# EasyEDA Pro project ProPrj_FireWheels_2025-05-03.epro, board PCB1
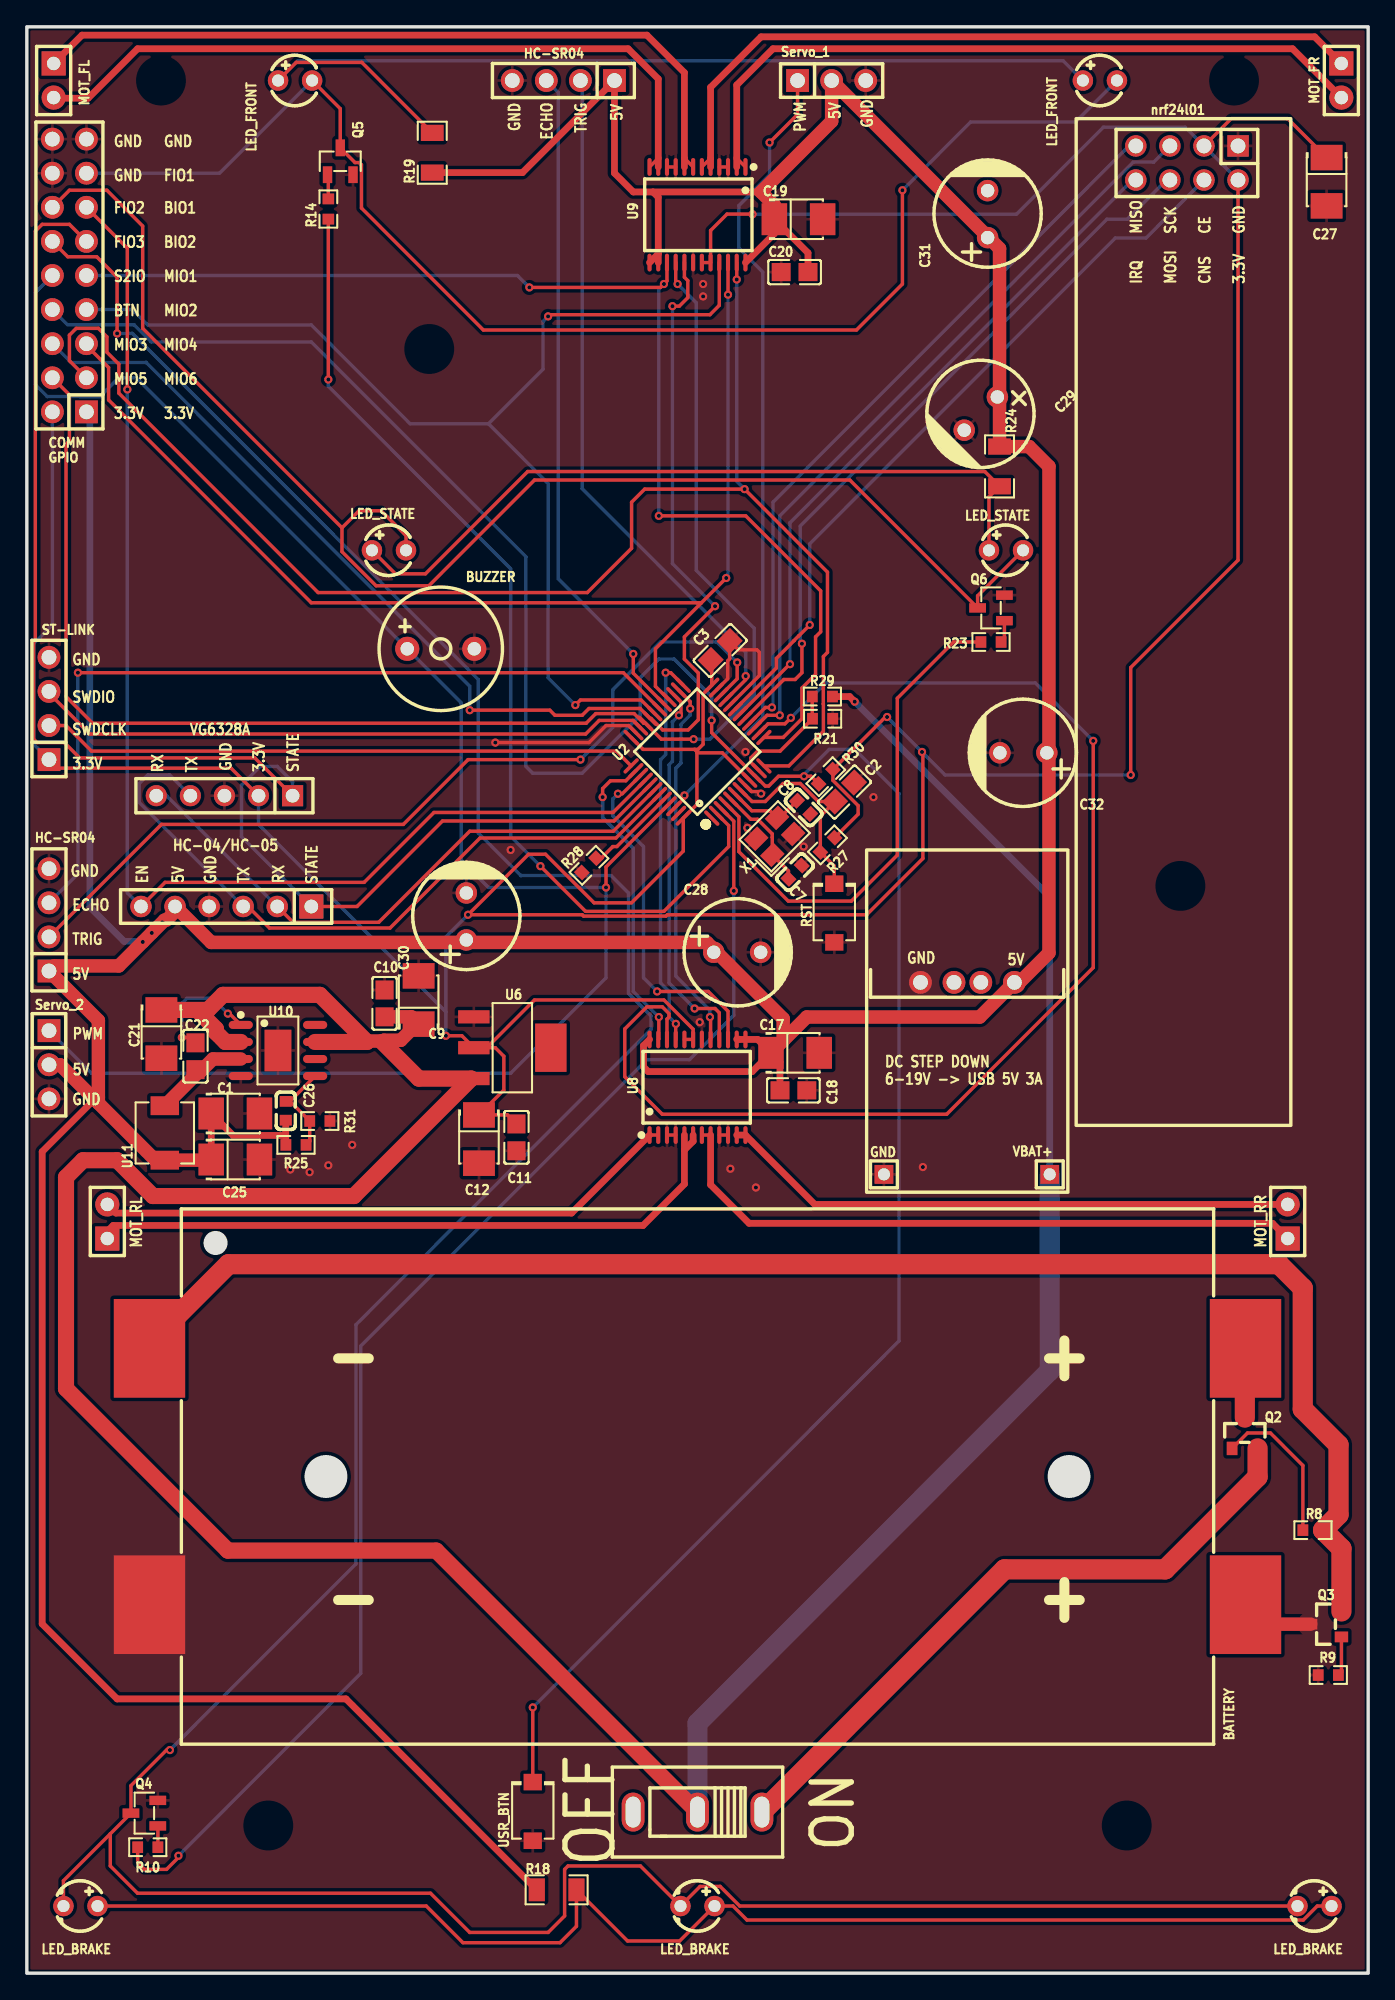
[diagram p2: board, top side]
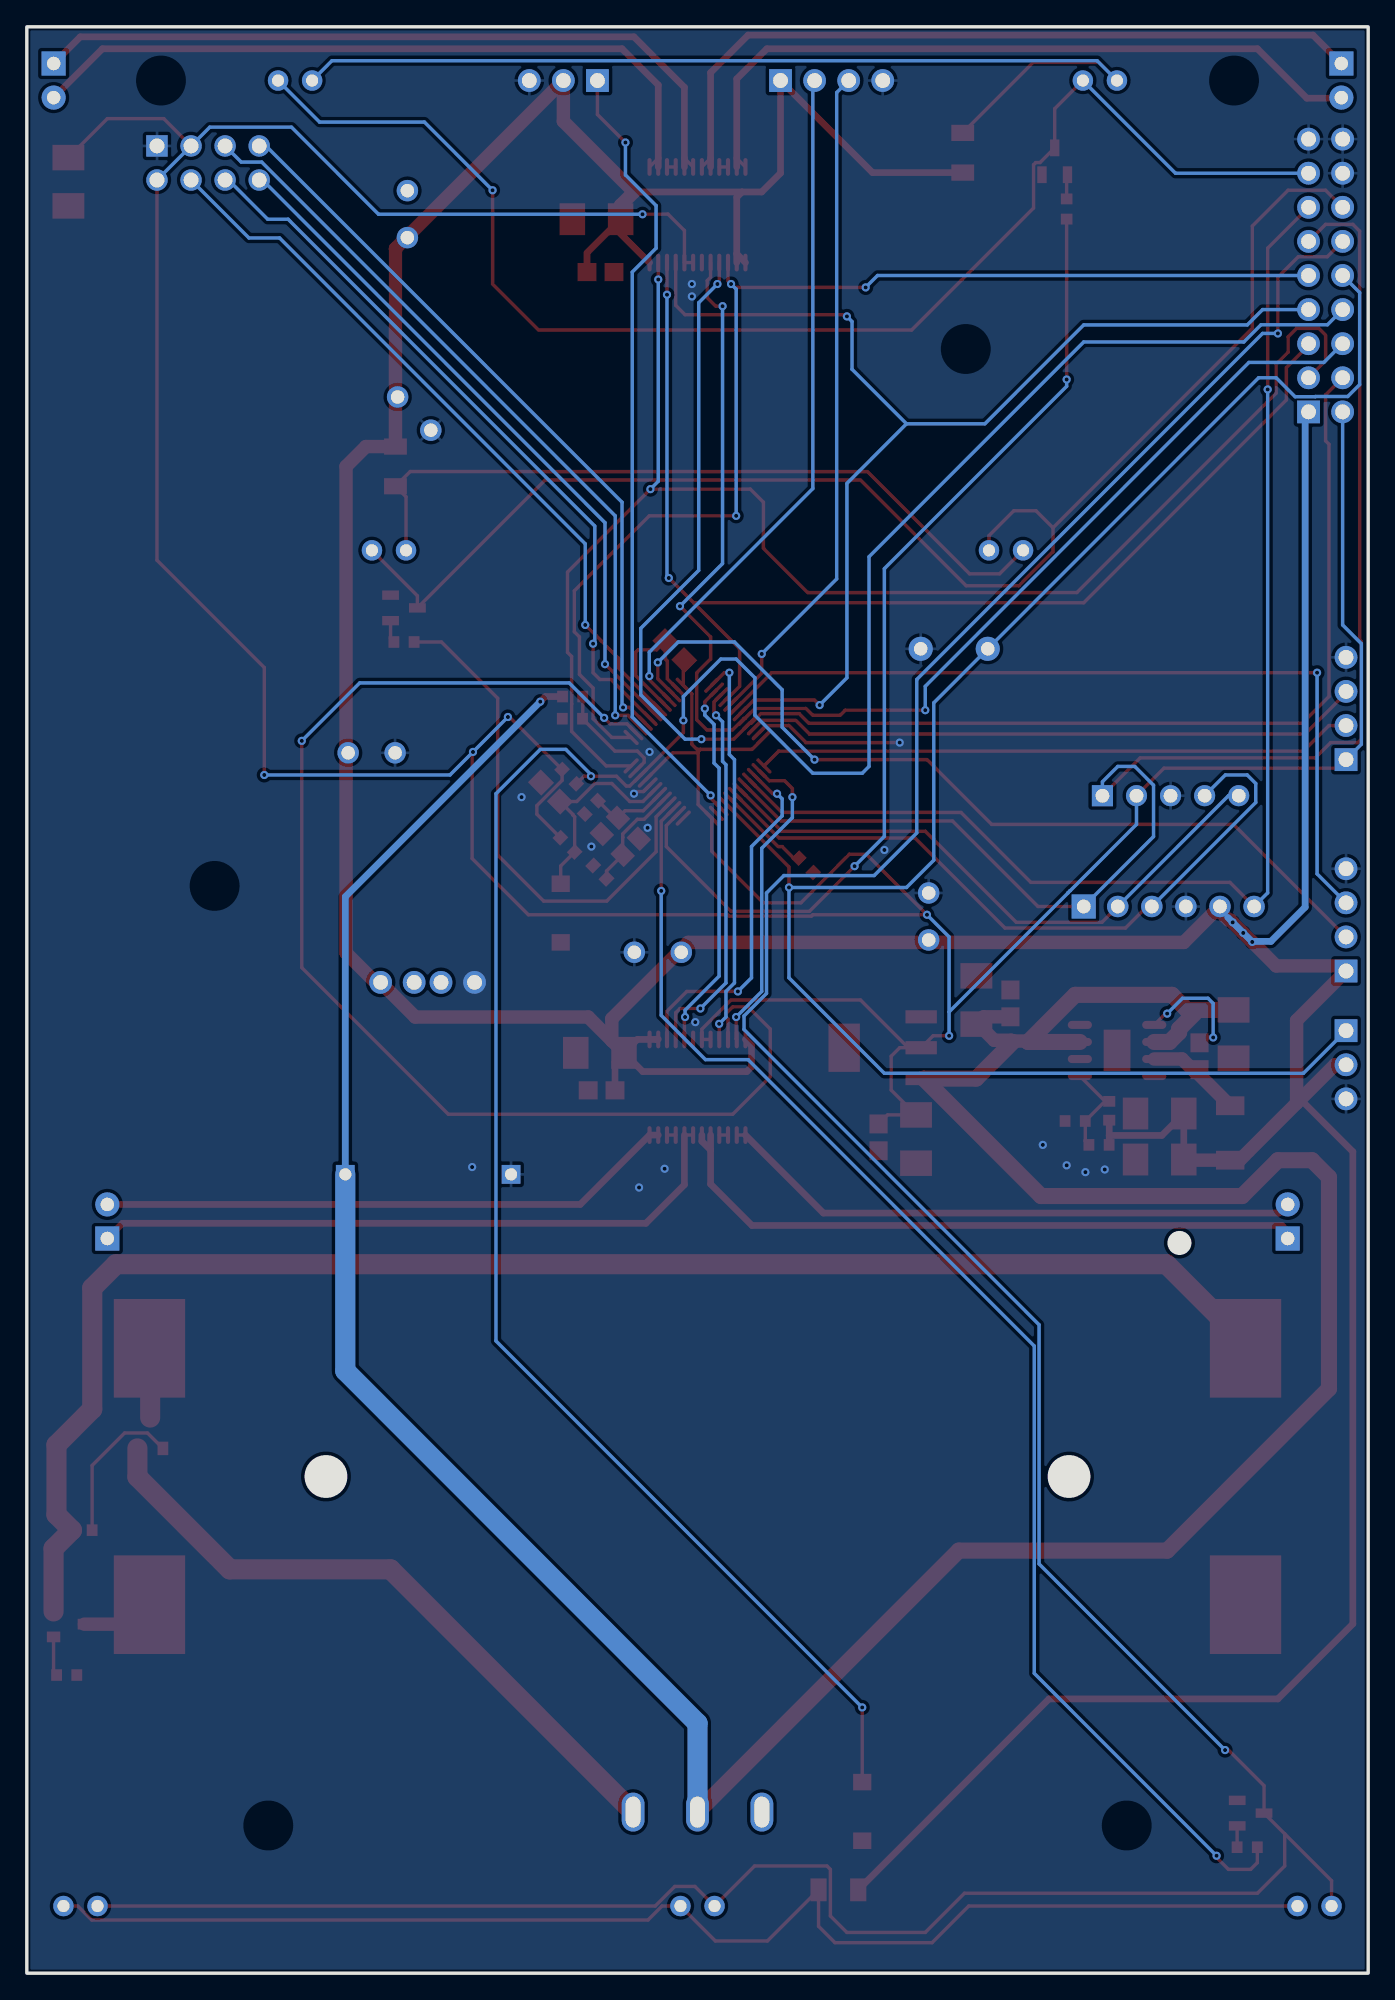
[diagram p3: board, bottom side, seen from below]

Outline 100 x 145 mm; copper layers: Top Layer, Bottom Layer. Coordinates in mm from the lower left corner of the outline.
Outline path: rectangle 0,145 100,0
Stack: Top Layer 0.035mm / Dielectric1 1.51mm FR4 er 4.5 / Bottom Layer 0.035mm

## Design rules (mm)
net VBAT+: POWER
net +5V: POWER
template: Custom Config
spacing copperThickness1oz (default): track to track 0.102, other pairs 0.152 to 0.3
spacing copperThickness2oz: track to track 0.203, other pairs 0.152 to 0.3
track width copperThickness1oz: min 0.127, default 0.254, max 2.54
track width copperThickness2oz: min 0.203, default 0.254, max 2.54
track width trackWidthLogic (default): min 0.127, default 0.254, max 2.54
track width trackWidthPower: min 0.254, default 0.5, max 3
differential pair differentialPair (default): width min 0.127, default 0.254, max 2.54; gap min 0.152, default 0.152
via viaSize (default): diameter min 0.5, default 0.61, max 10; hole min 0.3, default 0.305, max 6.3
net class POWER uses trackWidthPower
net VBAT+ uses trackWidthPower
net +5V uses trackWidthPower

## Placement (name value [footprint] x y rotation side)
BATTERY  -  [BAT-SMD_BH-18650-B1BA007]  50 37 180 top
BUZZER  -  [BUZ-TH_BD9.0-P5.00-D0.6-FD]  30.86 98.66 0 top
C1  22uF  [CAP-SMD_L3.5-W2.8-FD]  15.55 64.04 0 top
C2  100nF  [C0805]  60.96 88 225 top
C3  100nF  [C0805]  51.69 98.54 225 top
C7  20pF  [C0603]  57.28 82.03 225 top
C8  20pF  [C0603]  57.91 86.85 135 top
C9  22uF  [CAP-SMD_L3.5-W2.8-FD]  29.21 72.5 90 top
C10  100nF  [C0805]  26.67 72.25 270 top
C11  100nF  [C0805]  36.5 62.27 90 top
C12  22uF  [CAP-SMD_L3.5-W2.8-FD]  33.71 62.14 270 top
C17  22uF  [CAP-SMD_L3.5-W2.8-FD]  57.28 68.56 0 top
C18  100nF  [C0805]  57.15 65.77 180 top
C19  22uF  [CAP-SMD_L3.5-W2.8-FD]  57.53 130.67 0 top
C20  100nF  [C0805]  57.24 126.73 0 top
C21  22uF  [CAP-SMD_L3.5-W2.8-FD]  10.03 69.96 270 top
C22  100nF  [C0805]  12.57 68.31 270 top
C25  22uF  [CAP-SMD_L3.5-W2.8-FD]  15.55 60.61 0 top
C26  430pF  [C0603]  19.3 64.25 270 top
C27  22uF  [CAP-SMD_L3.5-W2.8-FD]  96.9 133.46 270 top
C28  470uF  [CAP-TH_BD8.0-P3.50-D0.6-FD]  52.96 76.06 0 top
C29  470uF  [CAP-TH_BD8.0-P3.50-D0.6-FD]  71.12 116.19 225 top
C30  470uF  [CAP-TH_BD8.0-P3.50-D0.6-FD]  32.77 78.72 90 top
C31  470uF  [CAP-TH_BD8.0-P3.50-D0.6-FD]  71.63 131.05 90 top
C32  470uF  [CAP-TH_BD8.0-P3.50-D0.6-FD]  74.29 90.92 180 top
COMM
GPIO  -  [HDR-TH_18P-P2.54-V-M-R2-C9-S2.54]  3.17 126.48 90 top
GND  -  [HDR-TH_1P-V-M_XKB_X4611WV-01I-C28D40]  63.9 59.51 0 top
H3  -  [HDR-TH_2P-P2.54-V-M-1]  6 56 90 top
H4  -  [HDR-TH_2P-P2.54-V-M-1]  94 56 90 top
H11  -  [HDR-TH_6P-P2.54-V-F]  14.86 79.47 180 top
H17  -  [HDR-TH_5P-P2.54-V-F]  14.73 87.72 180 top
HC-SR04  -  [HDR-TH_4P-P2.54-V-F]  40 141 180 top
HC-SR04#2  -  [HDR-TH_4P-P2.54-V-F]  1.65 78.47 90 top
LED_BRAKE  -  [LED-TH_BD3.8-P2.54-RD]  4 5 0 top
LED_BRAKE#2  -  [LED-TH_BD3.8-P2.54-RD]  50 5 0 top
LED_BRAKE#3  -  [LED-TH_BD3.8-P2.54-RD]  96 5 0 top
LED_FRONT  -  [LED-TH_BD3.8-P2.54-FD_WHITE]  20 141 0 top
LED_FRONT#2  -  [LED-TH_BD3.8-P2.54-FD_WHITE]  80 141 0 top
LED_STATE  -  [LED-TH_BD3.8-P2.54-FD_BLUE]  73 106 0 top
LED_STATE#2  -  [LED-TH_BD3.8-P2.54-FD_BLUE]  27 106 0 top
MOT_FL  -  [HDR-TH_2P-P2.54-V-M-1]  2 141 270 top
MOT_FR  -  [HDR-TH_2P-P2.54-V-M-1]  98 141 270 top
nrf24l01  -  [HDR-TH_8P-P2.54-V-F-R2-C4-S2.54-1]  86.49 134.86 180 top
ON  -  [SW-TH_SHOU-HAN_SS12D10G4]  50 12 180 top
Q2  AO3401A  [SOT-23_L2.9-W1.3-P1.90-LS2.4-BR]  90.81 40.24 270 top
Q3  AO3401A  [SOT-23_L2.9-W1.3-P1.90-LS2.4-BR]  96.86 26 0 top
Q4  AO3400A  [SOT-23-3_L2.9-W1.3-P1.90-LS2.4-BR]  8.76 11.92 0 top
Q5  AO3400A  [SOT-23-3_L2.9-W1.3-P1.90-LS2.4-BR]  23.37 134.99 270 top
Q6  AO3400A  [SOT-23-3_L2.9-W1.3-P1.90-LS2.4-BR]  71.88 101.71 0 top
R8  100Ω  [R0603]  95.88 33 180 top
R9  100Ω  [R0603]  97.03 22.21 0 top
R10  1kΩ  [R0603]  9.02 9.38 0 top
R14  1kΩ  [R0603]  22.48 131.43 90 top
R18  75Ω  [R1206]  39.5 6.21 0 top
R19  47Ω  [R1206]  30.23 135.62 90 top
R21  5kΩ  [R0603]  59.33 93.46 180 top
R23  1kΩ  [R0603]  71.88 99.17 0 top
R24  47Ω  [R1206]  72.52 112.25 270 top
R25  44.2kΩ  [R0603]  20.07 61.71 180 top
R27  10kΩ  [R0603]  59.69 84.06 45 top
R28  10kΩ  [R0603]  41.91 82.53 45 top
R29  10kΩ  [R0603]  59.31 95.11 180 top
R30  10kΩ  [R0603]  59.56 89.14 45 top
R31  10kΩ  [R0603]  21.84 63.48 0 top
RST  -  [SW-SMD_L3.9-W3.0-P4.45]  60.2 78.98 90 top
Servo_1  -  [HDR-TH_3P-P2.54-V-M]  60 141 0 top
Servo_2  -  [HDR-TH_3P-P2.54-V-M]  1.65 67.67 270 top
ST-LINK  -  [HDR-TH_4P-P2.54-V-M]  1.65 94.22 90 top
U2  STM32F103C8T6  [LQFP-48_L7.0-W7.0-P0.50-LS9.0-BL]  50 91 45 top
U6  AMS1117-3.3  [SOT-223-3_L6.7-W3.7-P2.30-LS7.0-BR]  36.19 68.94 180 top
U8  TB6612FNG,C,8,EL  [SSOP-24_L8.3-W5.6-P0.65-LS7.6-BL]  50 66 0 top
U9  TB6612FNG,C,8,EL  [SSOP-24_L8.3-W5.6-P0.65-LS7.6-BL]  50 131 180 top
U10  MP1484  [SOP-8_L4.9-W3.9-P1.27-LS6.0-BL-EP3.1]  18.72 68.74 270 top
U11  4.7uH  [IND-SMD_L4.4-W4.2]  10.29 62.59 90 top
USB1  AF 90° WJDG  [USB-A-TH_AF-WJDG]  70.1 75.17 180 top
USR_BTN  -  [SW-SMD_L3.9-W3.0-P4.45]  37.72 12.05 90 top
VBAT+  -  [HDR-TH_1P-V-M_XKB_X4611WV-01I-C28D40]  76.26 59.51 0 top
X1  8MHz  [CRYSTAL-SMD_4P-L3.2-W2.5-BL]  55.75 84.69 45 top

## Footprints (pads in the part's own frame, mm; a bottom-side part is the same pattern mirrored in y, then rotated)
BAT-SMD_BH-18650-B1BA007
  rect 5.32x7.35 smd: 1(-40.855,9.55) 2(40.855,9.55) 3(-40.855,-9.55) 4(40.855,-9.55)
BUZ-TH_BD9.0-P5.00-D0.6-FD
  round 1.8 hole 1: 1(-2.5,0) 2(2.5,0)
C0603
  rect 0.8x0.9 smd: 1(-0.7,0) 2(0.7,0)
C0805
  rect 1.41x1.35 smd: 1(-1,0) 2(1,0)
CAP-SMD_L3.5-W2.8-FD
  rect 1.9x2.376 smd: 1(-1.798,0) 2(1.798,0)
CAP-TH_BD8.0-P3.50-D0.6-FD
  round 1.6 hole 1: 1(-1.75,0) 2(1.75,0)
CRYSTAL-SMD_4P-L3.2-W2.5-BL
  rect 1.4x1.2 smd: 1(-1.1,-0.85) 2(1.1,-0.85) 3(1.1,0.85) 4(-1.1,0.85)
HDR-TH_1P-V-M_XKB_X4611WV-01I-C28D40
  rect 1.4x1.4 hole 0.9: 1(0,0)
HDR-TH_2P-P2.54-V-M-1
  rect 1.8x1.8 hole 1: 1(-1.27,0)
  round 1.8 hole 1: 2(1.27,0)
HDR-TH_3P-P2.54-V-M
  rect 1.7x1.7 hole 1.1: 1(-2.54,0)
  round 1.7 hole 1.1: 2(0,0) 3(2.54,0)
HDR-TH_4P-P2.54-V-F
  rect 1.7x1.7 hole 1.1: 1(-3.81,0)
  round 1.7 hole 1.1: 2(-1.27,0) 3(1.27,0) 4(3.81,0)
HDR-TH_4P-P2.54-V-M
  rect 1.7x1.7 hole 1.1: 1(-3.81,0)
  round 1.7 hole 1.1: 2(-1.27,0) 3(1.27,0) 4(3.81,0)
HDR-TH_5P-P2.54-V-F
  rect 1.575x1.575 hole 1.02: 1(-5.08,0)
  round 1.575 hole 1.02: 2(-2.54,0) 3(0,0) 4(2.54,0) 5(5.08,0)
HDR-TH_6P-P2.54-V-F
  rect 1.8x1.8 hole 1.02: 1(-6.35,0)
  round 1.6 hole 1.02: 2(-3.81,0) 3(-1.27,0) 4(1.27,0) 5(3.81,0) 6(6.35,0)
HDR-TH_8P-P2.54-V-F-R2-C4-S2.54-1
  rect 1.6x1.6 hole 1.1: 1(-3.81,-1.27)
  round 1.6 hole 1.1: 2(-3.81,1.27) 3(-1.27,-1.27) 4(-1.27,1.27) 5(1.27,-1.27) 6(1.27,1.27) 7(3.81,-1.27) 8(3.81,1.27)
HDR-TH_18P-P2.54-V-M-R2-C9-S2.54
  rect 1.7x1.7 hole 1.1: 1(-10.16,-1.27)
  round 1.7 hole 1.1: 2(-10.16,1.27) 3(-7.62,-1.27) 4(-7.62,1.27) 5(-5.08,-1.27) 6(-5.08,1.27) 7(-2.54,-1.27) 8(-2.54,1.27) 9(0,-1.27) 10(0,1.27) 11(2.54,-1.27) 12(2.54,1.27) 13(5.08,-1.27) 14(5.08,1.27) 15(7.62,-1.27) 16(7.62,1.27) 17(10.16,-1.27) 18(10.16,1.27)
IND-SMD_L4.4-W4.2
  rect 1.4x2.12 smd: 1(2.028,0) 2(-2.028,0)
LED-TH_BD3.8-P2.54-FD_BLUE
  round 1.524 hole 0.9: 1(-1.27,0) 2(1.27,0)
LED-TH_BD3.8-P2.54-FD_WHITE
  round 1.524 hole 0.9: 1(-1.27,0) 2(1.27,0)
LED-TH_BD3.8-P2.54-RD
  round 1.524 hole 0.9: 1(-1.27,0) 2(1.27,0)
LQFP-48_L7.0-W7.0-P0.50-LS9.0-BL
  oval 0.27x1.5 smd: 1(-2.75,-4.25) 2(-2.25,-4.25) 3(-1.75,-4.25) 4(-1.25,-4.25) 5(-0.75,-4.25) 6(-0.25,-4.25) 7(0.25,-4.25) 8(0.75,-4.25) 9(1.25,-4.25) 10(1.75,-4.25) 11(2.25,-4.25) 12(2.75,-4.25) 25(2.75,4.25) 26(2.25,4.25) 27(1.75,4.25) 28(1.25,4.25) 29(0.75,4.25) 30(0.25,4.25) 31(-0.25,4.25) 32(-0.75,4.25) 33(-1.25,4.25) 34(-1.75,4.25) 35(-2.25,4.25) 36(-2.75,4.25)
  oval 1.5x0.27 smd: 13(4.25,-2.75) 14(4.25,-2.25) 15(4.25,-1.75) 16(4.25,-1.25) 17(4.25,-0.75) 18(4.25,-0.25) 19(4.25,0.25) 20(4.25,0.75) 21(4.25,1.25) 22(4.25,1.75) 23(4.25,2.25) 24(4.25,2.75) 37(-4.25,2.75) 38(-4.25,2.25) 39(-4.25,1.75) 40(-4.25,1.25) 41(-4.25,0.75) 42(-4.25,0.25) 43(-4.25,-0.25) 44(-4.25,-0.75) 45(-4.25,-1.25) 46(-4.25,-1.75) 47(-4.25,-2.25) 48(-4.25,-2.75)
R0603
  rect 0.806x0.864 smd: 1(-0.753,0) 2(0.753,0)
R1206
  rect 1.208x1.701 smd: 1(-1.479,0) 2(1.479,0)
SOP-8_L4.9-W3.9-P1.27-LS6.0-BL-EP3.1
  oval 0.6x1.8 smd: 1(-1.905,-2.772) 2(-0.635,-2.772) 3(0.635,-2.772) 4(1.905,-2.772) 5(1.905,2.772) 6(0.635,2.772) 7(-0.635,2.772) 8(-1.905,2.772)
  rect 3.1x2 smd: 9(0,0)
SOT-23-3_L2.9-W1.3-P1.90-LS2.4-BR
  rect 1.25x0.7 smd: 1(1,-0.95) 2(1,0.95) 3(-1,0)
SOT-23_L2.9-W1.3-P1.90-LS2.4-BR
  rect 1x0.8 smd: 1(1.15,-0.95) 2(1.15,0.95) 3(-1.15,0)
SOT-223-3_L6.7-W3.7-P2.30-LS7.0-BR
  rect 2.34x0.98 smd: 1(2.87,-2.3) 2(2.87,0) 3(2.87,2.3)
  rect 2.34x3.6 smd: 4(-2.87,0)
SSOP-24_L8.3-W5.6-P0.65-LS7.6-BL
  oval 0.308x1.324 smd: 1(-3.575,-3.562) 2(-2.925,-3.562) 3(-2.275,-3.562) 4(-1.625,-3.562) 5(-0.975,-3.562) 6(-0.325,-3.562) 7(0.325,-3.562) 8(0.975,-3.562) 9(1.625,-3.562) 10(2.275,-3.562) 11(2.925,-3.562) 12(3.575,-3.562) 13(3.575,3.562) 14(2.925,3.562) 15(2.275,3.562) 16(1.625,3.562) 17(0.975,3.562) 18(0.325,3.562) 19(-0.325,3.562) 20(-0.975,3.562) 21(-1.625,3.562) 22(-2.275,3.562) 23(-2.925,3.562) 24(-3.575,3.562)
SW-SMD_L3.9-W3.0-P4.45
  rect 1.23x1.36 smd: 1(-2.185,0) 2(2.185,0)
SW-TH_SHOU-HAN_SS12D10G4
  oval 1.7x2.9 hole 1.1x2.3: 1(-4.8,0) 2(0,0) 3(4.8,0)
USB-A-TH_AF-WJDG
  round 1.7 hole 1.1: 1(-3.521,1.355) 2(-1.018,1.355) 3(0.981,1.355) 4(3.48,1.355)

## Nets
+5V: C1.1 C17.1 C18.2 C19.1 C20.2 C25.1 C26.2 C28.1 C29.1 C30.1 C31.1 C32.1 COMM
GPIO.1 H11.5 HC-SR04.1 HC-SR04#2.1 R18.1 R19.1 R24.1 R25.2 Servo_1.2 Servo_2.2 U8.13 U8.14 U8.24 U9.13 U9.14 U9.24 U11.2 USB1.1
GND: BATTERY.2 BUZZER.2 C1.2 C2.1 C3.1 C7.1 C8.1 C9.2 C10.1 C11.1 C12.2 C17.2 C18.1 C19.2 C20.1 C21.2 C25.2 C27.2 C28.2 C29.2 C30.2 C32.2 COMM
GPIO.16 COMM
GPIO.17 COMM
GPIO.18 GND.1 H11.4 H17.3 HC-SR04.4 HC-SR04#2.4 nrf24l01.1 Q4.2 Q5.2 Q6.2 R9.1 R21.1 R28.1 R31.2 RST.1 Servo_1.3 Servo_2.3 ST-LINK.4 U2.8 U2.20 U2.23 U2.35 U2.47 U6.1 U8.3 U8.4 U8.9 U8.10 U8.18 U9.3 U9.4 U9.9 U9.10 U9.18 U10.4 U10.9 USB1.4 USR_BTN.1 X1.2 X1.4
VBAT: U2.1
VBAT+: C9.1 C10.2 C21.1 ON.2 R29.1 U6.3 U10.2 U10.7 VBAT+.1
VCC: C3.2 C11.2 C12.1 C27.1 COMM
GPIO.2 H17.2 nrf24l01.2 nrf24l01.3 R27.2 R30.2 ST-LINK.1 U2.9 U2.24 U2.36 U2.48 U6.2 U8.19 U8.20 U9.19 U9.20
ABATT: R21.2 R29.2 U2.11
BTEN: COMM
GPIO.13 H11.6 U2.40
BTN: COMM
GPIO.8 R30.1 U2.10 USR_BTN.2
BTRX: H11.2 H17.5 U2.42
BTSTATE: COMM
GPIO.11 H11.1 H17.1 U2.41
BTTX: H11.3 H17.4 U2.43
CNS: nrf24l01.4 U2.19
IRQ: nrf24l01.8 U2.18
LED_BRAKE: R10.1 U2.3
LED_FRONT: R14.1 U2.2
LED_SIG: R23.1 U2.4
M1IN1: U2.25 U8.21
M1IN2: U2.14 U8.22
M1PWM: U2.38 U8.23
M2IN1: U2.26 U8.17
M2IN2: U2.27 U8.16
M2PWM: U2.39 U8.15
M3IN1: COMM
GPIO.7 U2.31 U9.21
M3IN2: COMM
GPIO.5 U2.28 U9.22
M3PWM: COMM
GPIO.3 U2.12 U9.23
M4IN1: COMM
GPIO.6 U2.32 U9.17
M4IN2: COMM
GPIO.4 U2.33 U9.16
M4PWM: COMM
GPIO.9 U2.13 U9.15
MISO: nrf24l01.7 U2.16
MOSI: nrf24l01.6 U2.17
OSCIN: C7.2 U2.5 X1.1
OSCOUT: C8.2 U2.6 X1.3
PIO1: COMM
GPIO.12 LED_BRAKE.1 LED_BRAKE#2.1 LED_BRAKE#3.1 Q4.3
PIO2: COMM
GPIO.15 LED_FRONT.2 LED_FRONT#2.2 Q5.3
PIO3: COMM
GPIO.14 LED_STATE.2 LED_STATE#2.2 Q6.3
PS1ECHO: HC-SR04.3 U2.29
PS1TRIG: HC-SR04.2 U2.21
PS2ECHO: HC-SR04#2.3 U2.30
PS2TRIG: HC-SR04#2.2 U2.22
S1PWM: Servo_1.1 U2.46
S2PWM: BUZZER.1 COMM
GPIO.10 Servo_2.1 U2.45
SCK: nrf24l01.5 U2.15
SWDCLK: ST-LINK.2 U2.37
SWDIO: ST-LINK.3 U2.34
$1N523: R28.2 U2.44
$1N562: C2.2 R27.1 RST.2 U2.7
$1N2227: BATTERY.3 Q2.3
$1N2416: BATTERY.1 Q3.3
$1N2497: Q2.1 R8.2
$1N3339: Q3.1 R9.2
$1N3343: BATTERY.4 Q3.2 R8.1
$1N3721: H3.2 U8.1 U8.2
$1N3888: H3.1 U8.5 U8.6
$1N4434: MOT_FR.2 U9.1 U9.2
$1N4451: MOT_FR.1 U9.5 U9.6
$1N10379: ON.1 Q2.2
$1N12792: C22.1 U10.1
$1N12807: C22.2 U10.3 U11.1
$1N14747: C26.1 R25.1 R31.1 U10.5
$1N18675: MOT_FL.1 U9.7 U9.8
$1N18693: MOT_FL.2 U9.11 U9.12
$1N18729: H4.2 U8.11 U8.12
$1N18746: H4.1 U8.7 U8.8
$2N1074: Q6.1 R23.2
$2N1079: LED_STATE.1 LED_STATE#2.1 R24.2
$2N1081: Q5.1 R14.2
$2N1083: LED_FRONT.1 LED_FRONT#2.1 R19.2
$2N1094: Q4.1 R10.2
$2N1098: LED_BRAKE.2 LED_BRAKE#2.2 LED_BRAKE#3.2 R18.2

Pads without a net: C31 2; ON 3; U6 4; U10 6 8; USB1 2 3

## Via types
v1: diameter 0.61, hole 0.305, Top Layer to Bottom Layer, 79 vias

## Routing (per net, layer and track width the routed paths; a pad name or vN(x,y) marks a point on that pad's centre or on a via; arc(x,y) is an arc through that point)
+5V: length 407.9
  Top Layer w0.5: 4.83,64.88 1.14,61.2 1.14,26.02 6.73,20.43 23.79,20.43 R18.1 ; C18.2 56.15,67.89 C17.1 ; R19.1 36.95,134.14 HC-SR04.1 43.81,134.1 45.21,132.7 46.68,132.7 ; C17.1 54.08,67.17 46.33,67.17 45.97,67.52 45.97,69.11 U8.24 ; C17.1 54.48,69.56 U8.13 53.1,69.56 53.09,69.58 52.93,69.58 ; 19.3,62.41 19.3,61.71 R25.2 ; 19.3,62.41 15.38,62.41 C1.1 C25.1 ; 19.3,62.41 C26.2 ; U9.14 47.07,128.09 ; 47.07,128.09 47.07,132.31 46.68,132.7 ; 47.07,128.09 U9.13 ; 46.68,132.7 54.74,132.7 ; 5.33,65.26 5.11,65.04 ; U9.24 55.73,129.6 C19.1 58.24,128.16 C20.2
  Top Layer w1: 10.41,78.45 10.27,78.45 v1(9.31,77.5) v1(8.64,76.83) 6.86,75.04 2.03,75.04 HC-SR04#2.1 5.33,70.98 5.33,64.81 9.58,60.57 U11.2 13.7,60.57 C25.1 ; 56.39,69.47 58.15,71.23 71.04,71.23 USB1.1 74.01,73.81 76.2,76.01 76.2,112.25 74.72,113.73 R24.1 72.52,128.48 Servo_1.2 60,137.96 54.74,132.7 55.73,131.7 C19.1 ; 56.39,69.47 56.39,71.1 50.7,76.79 13.74,76.79 11.25,79.29 10.61,78.65 ; 56.39,69.47 C17.1 ; 5.11,65.04 2.47,67.67 Servo_2.2
  Bottom Layer w0.5: 10.47,78.65 v1(10.1,78.28) v1(9.31,77.5) 8.68,76.87 7.25,76.87 4.7,79.42 4.7,116.06 COMM
GPIO.1
GND: length 26.7
  Top Layer w0.254: 53.54,88.53 54.03,88.03 54.58,88.03 v1(54.74,87.87) ; U2.35 44.87,92.95 43.18,92.95 41.91,91.68 v1(34.93,91.68) ; U2.23 52.25,96.43 52.25,97.76 52.4,97.91 C3.1 53.05,98.59 54.43,98.59 54.61,98.41 54.61,96.67 52.47,94.54 ; U9.10 U9.9 ; U8.3 U8.4 ; U8.9 U8.10 ; U9.4 U9.3
  vias: v1(19.64,59.87) v1(21.08,59.67) v1(22.48,60.18) v1(24.26,61.71) v1(36.07,83.68) v1(50.16,70.85) v1(50.42,125.84) v1(50.42,124.91) v1(52.45,59.93) v1(53.57,90.98) v1(53.72,85.33) v1(54.36,58.53) v1(57.91,83.93) v1(63.12,87.61) v1(66.8,60.06)
VBAT+: length 252.8
  Top Layer w0.5: v1(61.72,94.73) 61.34,95.11 R29.1
  Top Layer w1: 26.43,69.44 25.42,69.44 25.35,69.37 ; 26.5,69.37 26.62,69.5 27.88,69.5 29.08,70.7 C9.1 28.67,71.25 C10.2
  Top Layer w1.2: U10.7 25.35,69.37 21.84,72.88 14.63,72.88 13.5,71.76 C21.1 ; 26.5,69.37 29.22,66.64 33.13,66.64 24.38,57.9 9.4,57.9 6.73,60.56 4.19,60.56 2.92,59.29 2.92,43.54 14.99,31.48 30.52,31.48 ON.2 ; 12.95,71.48 14.1,70.34 14.1,70.09 14.81,69.37 15.95,69.37
  Bottom Layer w0.5: VBAT+.1 76.26,80.19 v1(61.72,94.73)
  Bottom Layer w1.5: VBAT+.1 76.26,44.87 50,18.62 ON.2
VCC: length 334.9
  Top Layer w0.254: nrf24l01.3 89.79,138.16 94,138.16 C27.1 ; 49.78,91.17 45.94,91.17 U2.36 ; 49.78,91.17 49.95,91 49.95,90.92 ; 49.78,91.17 50.04,91.17 50.42,91.55 50.42,95.31 U2.24 51.06,97.75 C3.2 ; 53.89,88.88 51.85,90.92 49.95,90.92 ; 49.95,90.92 49.95,87.07 U2.48 48.94,83.59 45.09,79.74 42.29,79.74 38.67,83.36 37.4,83.36 v1(32.89,78.85) 41.41,78.85 41.51,78.75 47.65,78.75 47.75,78.85 62.61,78.85 66.8,83.04 66.8,90.92 ; 54.1,131.05 52.2,131.05 50.97,129.83 U9.20 U9.19 ; U8.20 U8.19 49.68,70.32 47.5,72.5 37.85,72.5 34.29,68.94 34.93,68.94 35.56,68.31 35.56,65.79 C12.1 35.83,63.94 C11.2 ; R27.2 61.98,86.34 61.98,86.98 60.1,88.86 R30.2 64.01,93.58 v1(64.13,93.58) ; H17.2 15.22,89.77 2.16,89.77 1.52,90.41 ; v1(82.3,89.27) 82.3,97.27 90.3,105.27 nrf24l01.2 ; U6.2 32.44,69.83 v1(31.24,69.83)
  Bottom Layer w0.254: ST-LINK.1 0.51,91.55 0.51,99.04 1.91,100.44 COMM
GPIO.2 ; 31.24,71.61 31.24,77.2 v1(32.89,78.85) ; 31.24,71.61 v1(31.24,69.83) ; 31.24,71.61 22.39,80.47 22.39,80.48 22.22,80.64 22.21,80.64 17.27,85.58 H17.2 ; v1(54.1,131.04) 73.78,131.04 80.26,137.53 86.36,137.53 nrf24l01.3 nrf24l01.2 ; v1(82.3,89.27) 68.45,89.27 v1(66.74,90.98) v1(64.13,93.58)
ABATT: length 8.7
  Top Layer w0.254: U2.11 53.97,90.21 53.97,90.53 54.48,91.04 56.16,91.04 R21.2 58.56,93.47 R29.2
BTEN: length 95.3
  Top Layer w0.254: 46.11,88.88 43.7,86.47 30.35,86.47 25.15,81.26 10.31,81.26 H11.6 ; v1(7.49,117.99) 7.49,128.51 COMM
GPIO.13
  Bottom Layer w0.254: H11.6 7.49,80.48 v1(7.49,117.99)
BTN: length 185.9
  Top Layer w0.254: USR_BTN.2 v1(37.72,19.8) ; R30.1 58.47,89.17 v1(57.94,89.17) 56.04,89.17 55.31,88.44 55.05,88.44 54.26,89.23 U2.10 51.05,92.42 51.05,93.2
  Bottom Layer w0.254: v1(51.05,93.33) 51.05,95.11 48.26,97.9 47.12,97.9 45.72,96.5 45.72,93.71 41.4,89.39 37.72,89.39 37.21,89.9 37.21,105.52 21.21,121.52 9.27,121.52 7.99,122.81 3.03,122.81 COMM
GPIO.8 ; v1(57.94,89.17) 57.94,89.3 59.82,91.17 61.72,91.17 65.02,87.87 65.02,47.1 v1(37.72,19.8)
BTRX: length 45.2
  Top Layer w0.254: H11.2 19.85,78.29 26.23,78.29 33.02,85.07 43.72,85.07 U2.42
  Bottom Layer w0.254: H11.2 10.41,87.72 H17.5
BTSTATE: length 109.6
  Top Layer w0.254: 46.46,88.53 43.78,85.84 30.99,85.84 24.62,79.47 H11.1 ; COMM
GPIO.11 3.17,130.29 1.14,130.29 0.64,129.78 0.64,99.32 0.51,99.19 0.51,91.93 0.76,91.68 2.79,91.68 3.94,90.53 17,90.53 H17.1
  Bottom Layer w0.254: H11.1 16,84.67 16,88.5 17.4,89.9 18.67,89.9 19.81,88.76 H17.1
BTTX: length 52.9
  Top Layer w0.254: H11.3 16.49,79.47 18.09,77.86 27.08,77.86 33.78,84.57 43.92,84.57 U2.43
  Bottom Layer w0.254: H17.4 10.65,89.27 9.02,89.27 8.38,88.63 8.38,87.21 H11.3
CNS: length 55.2
  Top Layer w0.254: U2.19 55.88,97.23 55.88,97.95 57.2,99.27 57.2,99.29 57.54,99.63 57.56,99.63 v1(58.37,100.44)
  Bottom Layer w0.254: nrf24l01.4 83.44,129.27 81.15,129.27 58.37,106.49 v1(58.37,100.44)
IRQ: length 52.1
  Top Layer w0.254: U2.18 56.87,97.52 v1(56.9,97.52)
  Bottom Layer w0.254: nrf24l01.8 82.42,133.59 56.9,108.06 v1(56.9,97.52)
LED_BRAKE: length 102.3
  Top Layer w0.254: R10.1 8.26,8.23 8.76,7.73 10.41,7.73 11.3,8.62 v1(11.3,8.75) ; U2.3 52.71,85.82 v1(52.71,80.63)
  Bottom Layer w0.254: v1(52.71,80.63) 52.71,71.36 49.4,68.06 46.23,68.06 24.89,46.72 24.89,22.34 v1(11.3,8.75)
LED_FRONT: length 75
  Top Layer w0.254: U2.2 52.32,85.49 52.32,83.93 47.5,79.11 41.66,79.11 v1(38.29,82.47) ; R14.1 v1(22.48,118.73)
  Bottom Layer w0.254: v1(22.48,118.73) 22.48,118.22 36.07,104.63 36.07,84.69 v1(38.29,82.47)
LED_SIG: length 38.4
  Top Layer w0.254: 52.12,87.11 53.09,86.15 53.09,83.55 56.77,79.87 61.47,79.87 64.9,83.3 64.9,94.98 69.09,99.17 R23.1
M1IN1: length 29.7
  Top Layer w0.254: U8.21 48.38,70.71 v1(48.39,70.72) ; U2.25 48,96.89 v1(47.62,96.89)
  Bottom Layer w0.254: v1(47.62,96.89) 47.62,90.79 47.24,90.41 47.24,73.77 47.88,73.14 47.88,71.23 v1(48.39,70.72)
M1IN2: length 95.3
  Top Layer w0.254: v1(56.96,93.52) 56.51,93.08 55.26,93.08 U2.14 ; 79.5,91.68 79.5,74.91 68.58,63.99 47.37,63.99 44.58,66.79 44.58,70.34 46.23,71.99 47.37,71.99 47.88,71.48 47.88,71.23 47.72,71.08 U8.22
  Bottom Layer w0.254: v1(56.96,93.52) 59.56,96.12 75.18,96.12 v1(79.5,91.81)
M1PWM: length 23.5
  Top Layer w0.254: v1(42.93,87.61) 42.93,88.25 43.51,88.83 44.65,88.83 U2.38 ; v1(47.12,71.23) 47.12,69.6 U8.23
  Bottom Layer w0.254: v1(42.93,87.61) 42.93,86.09 45.21,83.8 45.21,73.14 v1(47.12,71.23)
M2IN1: length 27.9
  Top Layer w0.254: U8.17 50.97,71.18 v1(50.93,71.23) ; U2.26 49.45,94.73 v1(49.45,94.21)
  Bottom Layer w0.254: v1(49.45,94.21) 49.45,93.72 48.77,93.04 48.77,90.15 48.39,89.77 48.39,74.28 50.93,71.74 v1(50.93,71.23)
M2IN2: length 28.7
  Top Layer w0.254: v1(49.78,71.87) 51.31,71.87 51.62,71.55 U8.16 ; U2.27 48.77,94.71 48.77,93.85 48.63,93.71 v1(48.62,93.71)
  Bottom Layer w0.254: v1(48.62,93.71) 48.13,93.23 48.13,90.28 47.88,90.03 47.88,73.77 v1(49.78,71.87)
M2PWM: length 26.5
  Top Layer w0.254: v1(46.99,73.14) 50.8,73.14 52.28,71.66 U8.15 ; U2.39 44.39,87.87 v1(44.07,87.87)
  Bottom Layer w0.254: v1(46.99,73.14) 45.97,74.15 45.97,83.93 43.69,86.22 43.69,87.49 v1(44.07,87.87)
M3IN1: length 89.8
  Top Layer w0.254: v1(38.86,123.43) 38.99,123.56 50.93,123.56 51.62,124.25 U9.21 ; U2.31 45.79,94.85 41.28,94.85 v1(40.89,94.47)
  Bottom Layer w0.254: 34.42,115.43 38.48,119.49 38.48,123.05 v1(38.86,123.43) ; 34.42,115.43 38.86,110.98 38.86,96.5 v1(40.89,94.47) ; 34.42,115.43 28.57,115.43 21.21,122.79 9.01,122.79 7.87,123.94 COMM
GPIO.7
M3IN2: length 90.6
  Top Layer w0.254: U9.22 v1(52.28,125.05) ; COMM
GPIO.5 4.44,121.27 6.1,119.62 6.1,117.2 21.21,102.09 50.29,102.09 ; v1(52.14,103.94) 50.29,102.09 ; 50.29,102.09 46.86,98.66 46.86,95.87 47.84,94.89 47.88,94.89
  Bottom Layer w0.254: v1(52.28,125.05) 52.28,104.08 v1(52.14,103.94)
M3PWM: length 112.9
  Top Layer w0.254: U2.12 56.81,89.94 59.38,92.52 59.38,94.55 59.38,94.56 59.38,95.65 59.38,95.66 59.38,98.09 59.69,98.4 59.69,104.38 v1(53.51,110.56) 46.06,110.56 45.09,109.58 45.09,106.16 41.78,102.85 21.72,102.85 6.86,117.71 6.86,119.87 5.97,120.76 5.97,121.9 5.33,122.54 3.68,122.54 3.17,122.03 3.17,120.13 COMM
GPIO.3 ; v1(52.93,126.18) U9.23
  Bottom Layer w0.254: v1(53.51,110.56) 52.93,111.14 v1(52.93,126.18)
M4IN1: length 99.5
  Top Layer w0.254: v1(33.02,94.09) 38.99,94.09 39.37,93.71 41.4,93.71 41.91,94.22 45.72,94.22 46.46,93.47 46.54,93.47 47.4,92.62 49.3,92.62 50.06,93.38 50.06,96.86 49.02,97.9 49.02,99.55 v1(51.31,101.84) ; U9.17 49.03,126.35 49.28,126.09 49.28,124.83 48.64,124.19 v1(48.13,124.19)
  Bottom Layer w0.254: COMM
GPIO.6 3.3,120 8.89,120 33.02,95.87 v1(33.02,94.09) ; v1(48.13,124.19) 48.13,105.01 v1(51.31,101.84)
M4IN2: length 113.6
  Top Layer w0.254: v1(48.51,125.84) 48.38,125.98 U9.16 ; v1(49.71,91.93) 47.3,91.93 46.11,93.12 45.99,93.12 45.27,93.84 42.42,93.84 41.7,93.12 4.91,93.12 2.92,95.11 2.92,113.9 3.17,114.16 3.17,117.59 COMM
GPIO.4
  Bottom Layer w0.254: v1(48.51,125.84) 49.91,124.44 49.91,104.5 54.23,100.19 54.23,95.23 50.93,91.93 v1(49.71,91.93)
M4PWM: length 90.5
  Top Layer w0.254: U9.15 47.72,126.07 v1(47.5,125.84) 47.24,125.59 v1(37.47,125.59) ; v1(47.12,108.57) 53.59,108.57 59.18,102.98 59.18,99.93 58.8,99.55 58.8,96.76 57.78,95.74 57.78,93.46 56.39,92.06 U2.13
  Bottom Layer w0.254: v1(47.12,108.57) 47.12,125.46 v1(47.5,125.84) ; v1(37.47,125.59) 36.58,126.48 COMM
GPIO.9
MISO: length 55.5
  Top Layer w0.254: v1(55.55,94.29) 55.06,94.29 53.89,93.12
  Bottom Layer w0.254: v1(55.55,94.29) 55.63,94.37 55.63,109.58 82.17,136.13 nrf24l01.7
MOSI: length 54.9
  Top Layer w0.254: v1(57.78,99.04) 57.78,96.89 57.28,96.38 56.44,96.38 53.54,93.47
  Bottom Layer w0.254: v1(57.78,99.04) 57.66,99.17 57.66,107.81 80.52,130.67 82.04,130.67 84.96,133.59 nrf24l01.6
OSCIN: length 8
  Top Layer w0.254: 52.47,87.46 53.98,85.96 54.48,85.96 55.57,84.87 55.57,84.62 55.58,84.62 X1.1 56.78,82.11 C7.2
OSCOUT: length 5.8
  Top Layer w0.254: 57.42,87.35 56.14,86.07 X1.3 55.4,86.6 54.05,86.6 U2.6
PIO1: length 266.2
  Top Layer w0.254: v1(6.73,122.16) 6.73,126.35 5.21,127.87 3.05,127.87 COMM
GPIO.12 ; v1(10.67,16.62) 10.41,16.62 7.76,13.97 Q4.3 6.22,10.38 ; LED_BRAKE.1 2.73,6.89 6.22,10.38 ; 6.22,10.38 6.22,7.99 8.25,5.95 30.1,5.95 33.02,3.03 38.86,3.03 40.09,4.26 40.09,7.73 40.35,7.99 45.75,7.99 LED_BRAKE#2.1 50.19,6.46 51.69,6.46 53.15,5 LED_BRAKE#3.1
  Bottom Layer w0.254: v1(6.73,122.16) 7.87,122.16 33.66,96.38 33.66,84.95 36.83,81.77 43.56,81.77 44.86,80.47 44.86,72.99 46.53,71.31 46.53,70.31 24.54,48.31 24.54,30.49 v1(10.67,16.62)
PIO2: length 102.8
  Top Layer w0.254: LED_FRONT.2 23.37,138.9 Q5.3 24.46,134.89 24.78,134.89 24.95,134.73 24.95,131.5 34.04,122.41 61.85,122.41 65.28,125.84 v1(65.28,132.83)
  Bottom Layer w0.254: v1(65.28,132.83) 70.36,137.91 78.18,137.91 LED_FRONT#2.2 ; LED_FRONT.2 14.37,134.1 COMM
GPIO.15
PIO3: length 107.3
  Top Layer w0.254: 23.5,107.68 8.64,122.54 8.64,130.16 5.97,132.83 3.17,132.83 COMM
GPIO.14 ; 23.5,107.68 24.77,108.95 26.42,108.95 28.27,107.1 LED_STATE#2.2 ; 23.5,107.68 23.5,105.9 26.03,103.36 29.97,103.36 37.85,111.24 61.36,111.24 Q6.3 70.88,102.61 LED_STATE.2
PS1ECHO: length 50.1
  Top Layer w0.254: 47.53,94.54 45.21,96.85 v1(45.21,98.28)
  Bottom Layer w0.254: HC-SR04.3 39.62,140.11 39.62,103.87 v1(45.21,98.28)
PS1TRIG: length 51.8
  Top Layer w0.254: v1(53.59,96.63) 53.59,96.36 52.12,94.89
  Bottom Layer w0.254: HC-SR04.2 41.4,140.87 41.4,110.6 53.59,98.41 v1(53.59,96.63)
PS2ECHO: length 62.5
  Top Layer w0.254: U2.30 44.47,96.89 v1(3.81,96.89)
  Bottom Layer w0.254: HC-SR04#2.3 3.81,81.9 v1(3.81,96.89)
PS2TRIG: length 65.6
  Top Layer w0.254: U2.22 52.96,96.43 v1(52.96,97.65) ; v1(41.28,90.41) 32.89,90.41 28.07,85.58 10.03,85.58 HC-SR04#2.2
  Bottom Layer w0.254: v1(52.96,97.65) 51.44,99.17 47.24,99.17 43.69,95.61 43.69,92.82 v1(41.28,90.41)
S1PWM: length 59.5
  Top Layer w0.254: v1(49.02,87.74) 49.02,87.55 U2.46 ; v1(55.37,136.38) 57.46,138.47 Servo_1.1
  Bottom Layer w0.254: v1(49.02,87.74) 54.86,93.58 54.86,126.73 53.09,128.51 53.09,131.68 55.37,133.97 v1(55.37,136.38)
S2PWM: length 135.4
  Top Layer w0.254: v1(43.18,80.88) 43.18,82.41 47.88,87.11
  Bottom Layer w0.254: COMM
GPIO.10 0.64,125.21 0.64,118.35 1.52,117.46 3.94,117.46 3.95,117.44 5.45,117.44 6.86,118.86 8.17,118.86 BUZZER.1 32.38,94.64 32.38,82.92 34.42,80.88 v1(43.18,80.88) 43.18,74.15 36.07,67.04 4.83,67.04 Servo_2.1
SCK: length 57.6
  Top Layer w0.254: v1(56.13,93.71) 55.19,93.71 U2.15
  Bottom Layer w0.254: nrf24l01.5 84.01,134.92 82.48,134.92 56.13,108.57 v1(56.13,93.71)
SWDCLK: length 44.8
  Top Layer w0.254: U2.37 43.95,91.04 4.83,91.04 2.92,92.95 1.52,92.95
SWDIO: length 46.2
  Top Layer w0.254: U2.34 45.2,93.33 42.67,93.33 41.66,92.31 4.7,92.31 1.52,95.49
$1N523: length 6.9
  Top Layer w0.254: 47.53,87.46 43.99,83.93 43.69,83.93 42.82,83.07 R28.2
$1N562: length 15.6
  Top Layer w0.254: U2.7 54.07,87.29 55.05,87.29 56.39,88.63 57.66,88.63 59,87.29 C2.2 59.29,86.32 59.29,86.28 59.16,86.15 R27.1 60.2,82.48 RST.2
$1N2227: length 5.2
  Top Layer w1.5: Q2.3 90.81,46.5 BATTERY.3
$1N2416: length 5.5
  Top Layer w1: Q3.3 92.31,26 BATTERY.1
$1N2497: length 11.6
  Top Layer w0.254: R8.2 95.13,37.82 92.71,40.24 91,40.24 Q2.1
$1N3339: length 2.9
  Top Layer w0.254: R9.2 98.01,22.43 Q3.1
$1N3343: length 115.8
  Top Layer w1.5: 9.14,46.55 9.14,46.93 15.03,52.82 93.34,52.82 95.12,51.04 95.12,42.02 97.79,39.35 97.79,34.16 R8.1 98.01,31.64 Q3.2
$1N3721: length 43.7
  Top Layer w0.254: U8.2 U8.1
  Top Layer w0.5: H3.2 6.64,56.63 40.61,56.63 U8.1
$1N3888: length 50.8
  Top Layer w0.5: 49.03,61.33 U8.5 ; 49.03,61.33 49.68,61.98 U8.6 ; 49.03,61.33 49.03,58.79 45.94,55.7 6.43,55.7 5.46,54.73 H3.1
$1N4434: length 54.7
  Top Layer w0.254: U9.1 52.93,135.21
  Top Layer w0.5: U9.2 52.93,140.67 55.63,143.37 94.36,143.37 MOT_FR.2
$1N4451: length 56.3
  Top Layer w0.254: U9.6 50.97,135.21
  Top Layer w0.5: MOT_FR.1 96.01,144.26 54.74,144.26 50.97,140.49 U9.5
$1N10379: length 49.4
  Top Layer w1.5: Q2.2 91.75,36.97 84.87,30.08 72.88,30.08 ON.1
$1N12792: length 9.5
  Top Layer w0.254: 15.95,70.64 15.11,71.48 v1(14.99,71.48) ; v1(11.56,69.71) 12.43,69.71 12.95,69.18
  Bottom Layer w0.254: v1(14.99,71.48) 13.84,72.63 11.94,72.63 11.56,72.25 v1(11.56,69.71)
$1N12807: length 7.1
  Top Layer w1: U11.1 12.85,67.18 12.95,67.18 13.88,68.1 15.95,68.1
$1N14747: length 7
  Top Layer w0.254: 19.61,64.95 U10.5 ; 19.61,64.95 C26.1 ; 19.61,64.95 19.63,64.95 R31.1 21.09,61.98 R25.1
$1N18675: length 57
  Top Layer w0.254: U9.7 49.03,135.21
  Top Layer w0.5: MOT_FL.1 4.11,144.38 46.23,144.38 49.03,141.59 U9.8
$1N18693: length 55
  Top Layer w0.254: U9.12 47.07,135.21
  Top Layer w0.5: U9.11 47.07,141.12 44.83,143.37 8.25,143.37 4.57,139.68 2.05,139.68 MOT_FL.2
$1N18729: length 43.2
  Top Layer w0.5: U8.11 U8.12 58.74,57.27 H4.2
$1N18746: length 49
  Top Layer w0.254: U8.7 U8.8
  Top Layer w0.5: H4.1 92.87,55.86 53.85,55.86 50.97,58.74 U8.8
$2N1074: length 1.7
  Top Layer w0.254: R23.2 72.88,99.42 Q6.1
$2N1079: length 56.2
  Top Layer w0.254: LED_STATE#2.1 27.48,104.25 29.72,104.25 37.34,111.87 71.42,111.87 R24.2 71.73,109.99 LED_STATE.1
$2N1081: length 1.8
  Top Layer w0.254: R14.2 22.48,133.92 Q5.1
$2N1083: length 75.5
  Top Layer w0.254: LED_FRONT.1 20.08,142.35 24.97,142.35 R19.2
  Bottom Layer w0.254: LED_FRONT.1 20.21,142.48 77.25,142.48 LED_FRONT#2.1
$2N1094: length 1.6
  Top Layer w0.254: R10.2 9.77,10.96 Q4.1
$2N1098: length 99.9
  Top Layer w0.254: LED_BRAKE.2 29.78,5 32.51,2.27 39.75,2.27 40.98,3.5 R18.2 44.79,2.4 48.67,2.4 LED_BRAKE#2.2 52.65,5 53.69,3.96 95.16,3.96 96.2,5 LED_BRAKE#3.2

## Copper pours and planes (outline as drawn; the poured copper is in the pictures)
GND on Top Layer: 0,145.25 100,145.25 100,0.25 0,0.25
GND on Bottom Layer: 0,145 100,145 100,0 0,0

## Text on the board
Top Silkscreen Layer: DC STEP DOWN / 6-19V -> USB 5V 3A | GND | 5V | ECHO | TRIG | SWDIO | SWDCLK | 3.3V | PWM | FIO2 | FIO3 | S2IO | BTN | MIO3 | MIO5 | FIO1 | BIO1 | BIO2 | MIO1 | MIO2 | MIO4 | MIO6 | HC-04/HC-05 | VG6328A | MOT_RL | EN | RX | TX | STATE | MISO | IRQ | SCK | MOSI | CE | CNS | MOT_RR | TO DO: / More VIAs / Add test points / Add more capacitors for stm32 etc. | OFF | - | +
